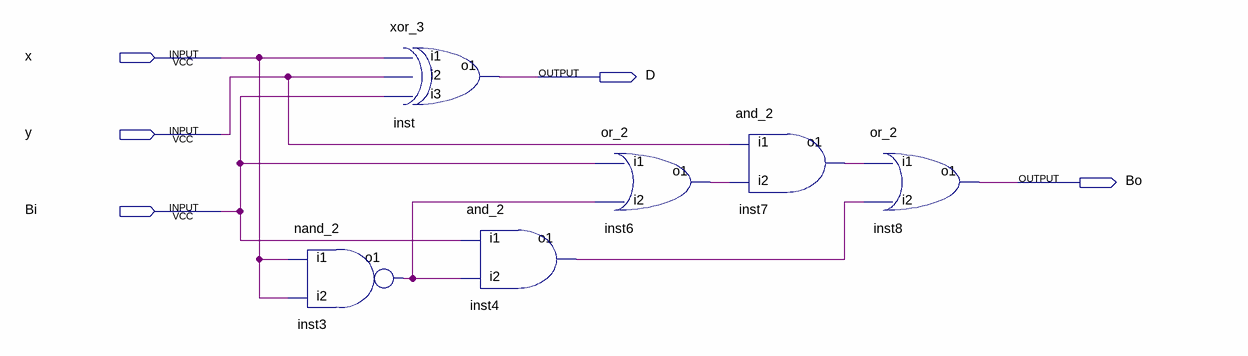
[diagram p0: schematic sheet]
// Quartus schematic FS.bdf as structural Verilog: 6 symbols, 5 pins
module FS (
  input  x,
  input  y,
  input  Bi,
  output D,
  output Bo
);

  wire inst3_o1, inst4_o1, inst6_o1, inst7_o1;

  nand_2 inst3 (.i1(x), .i2(x), .o1(inst3_o1));
  xor_3 inst (.i1(x), .i2(y), .i3(Bi), .o1(D));
  and_2 inst4 (.i1(Bi), .i2(inst3_o1), .o1(inst4_o1));
  or_2 inst6 (.i1(Bi), .i2(inst3_o1), .o1(inst6_o1));
  and_2 inst7 (.i1(y), .i2(inst6_o1), .o1(inst7_o1));
  or_2 inst8 (.i1(inst7_o1), .i2(inst4_o1), .o1(Bo));
endmodule
